# Altium schematic sheet AltiumSTM32_Schematic.SchDoc
size A3; SheetNumber: 1; SheetTotal: 1
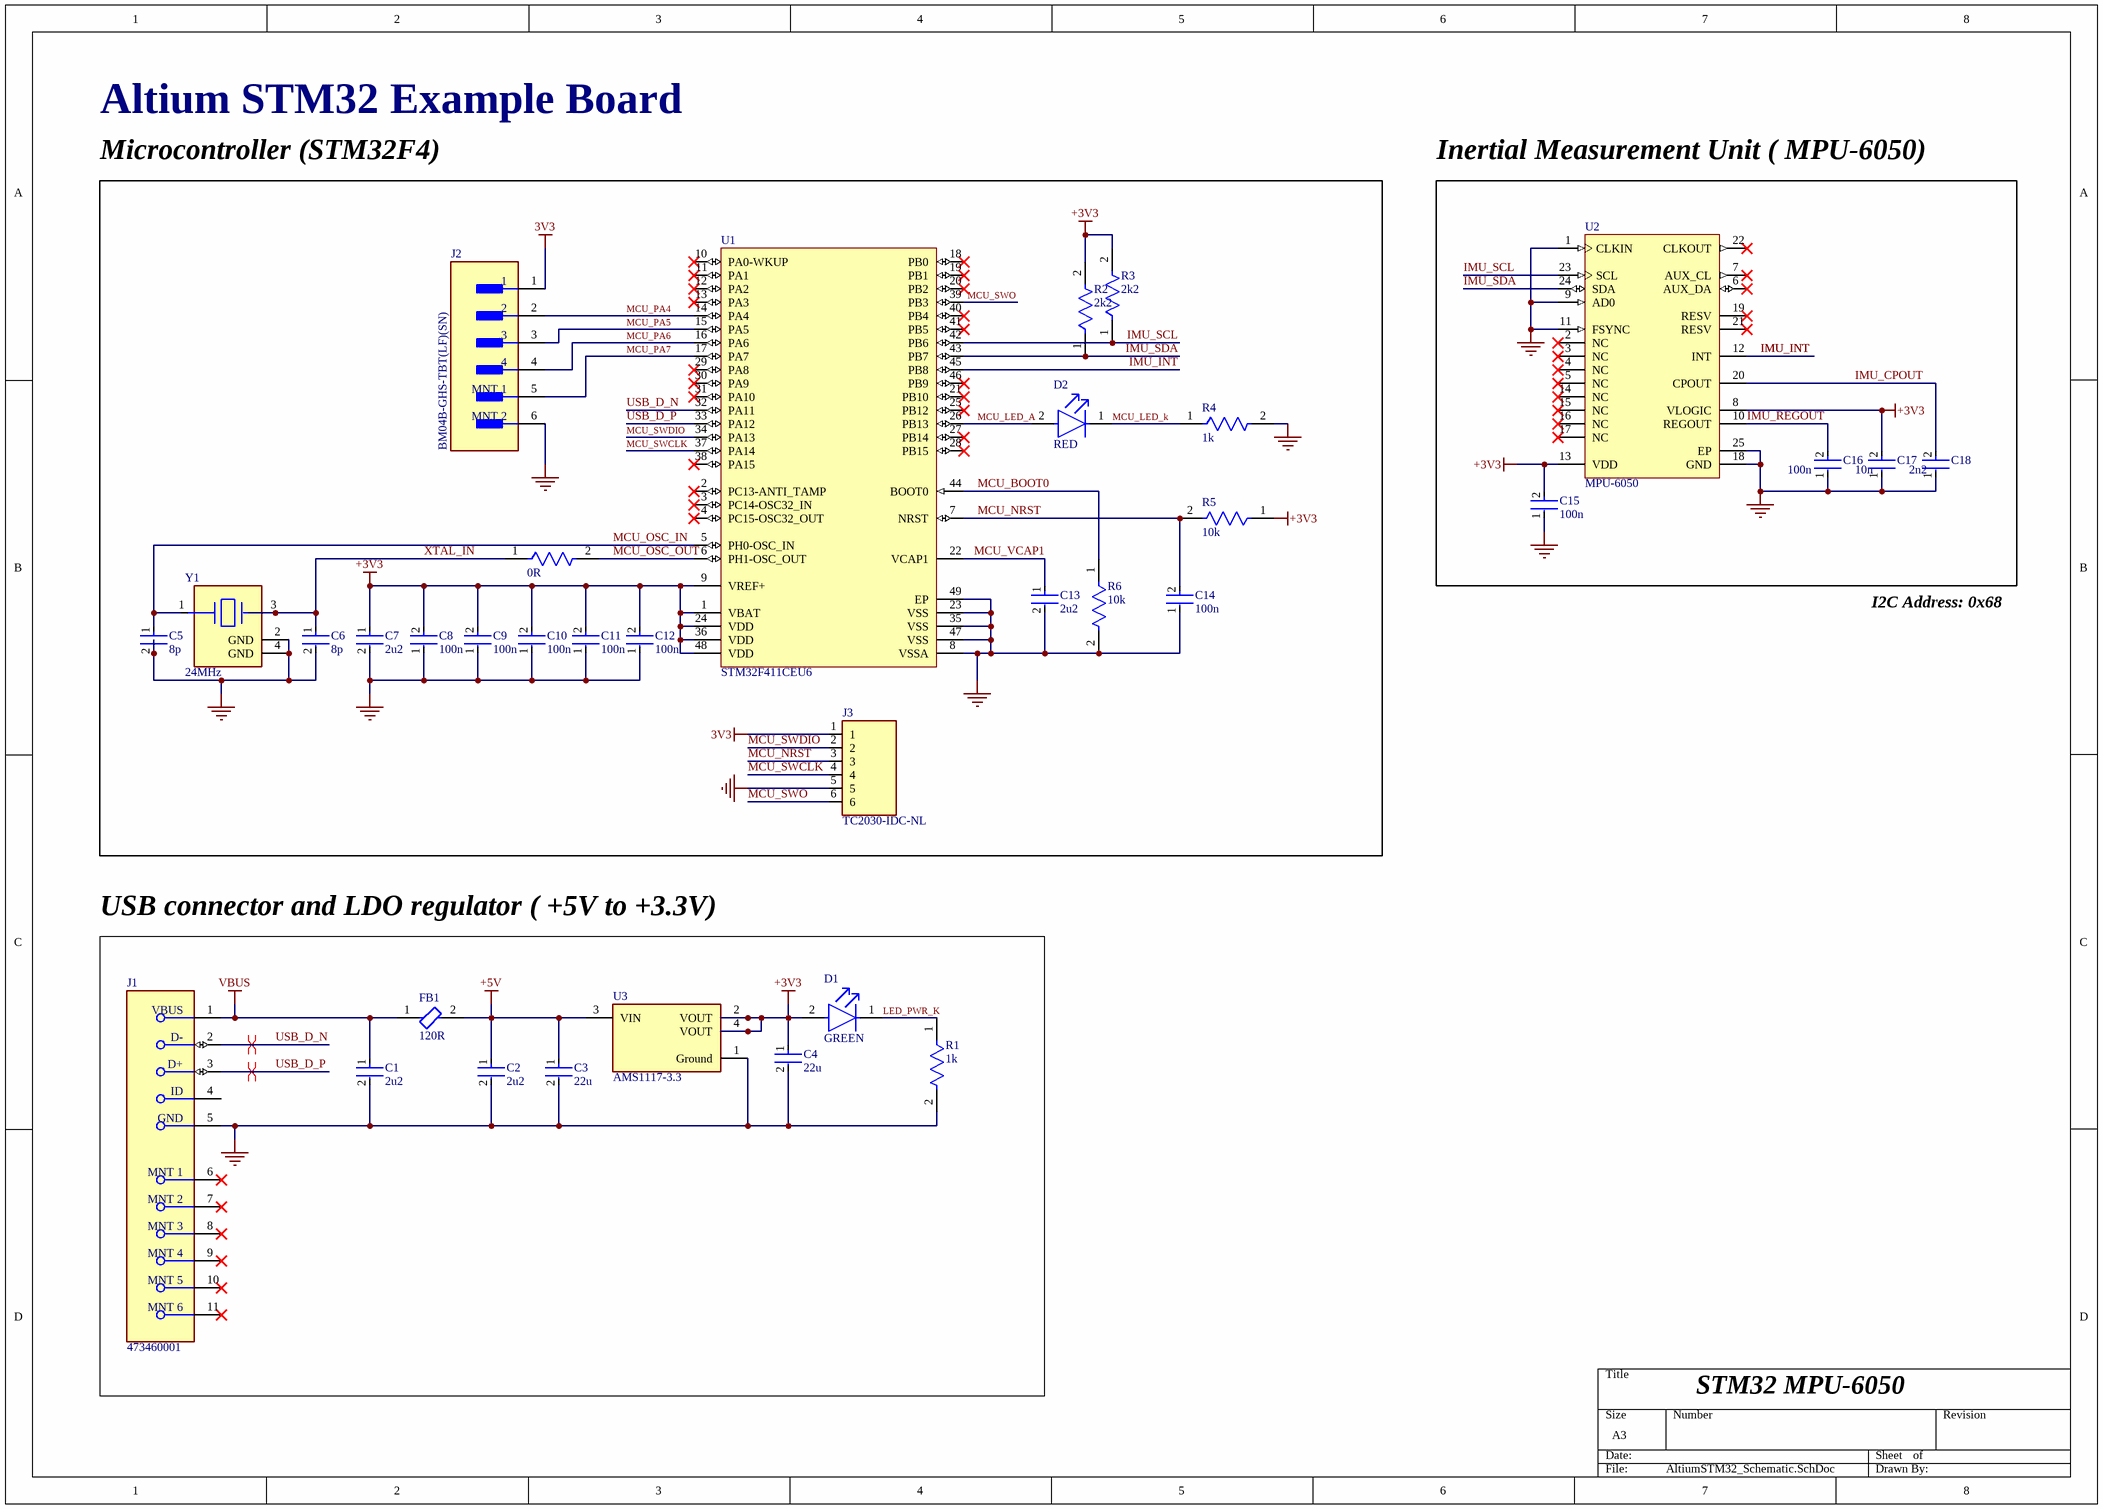
[diagram p0: AltiumSTM32_Schematic.SchDoc]

## Parts
C1  2u2  [FP-CC0603-DA-MFG]
C2  2u2  [FP-CC0603-DA-MFG]
C3  22u  [FP-GRT21B-0_2-MFG]
C4  22u  [FP-GRT21B-0_2-MFG]
C5  8p  [FP-CC0402-MFG]
C6  8p  [FP-CC0402-MFG]
C7  2u2  [FP-CC0603-DA-MFG]
C8  100n  [FP-CC0402-0_05-0_55-L2_0-MFG]
C9  100n  [FP-CC0402-0_05-0_55-L2_0-MFG]
C10  100n  [FP-CC0402-0_05-0_55-L2_0-MFG]
C11  100n  [FP-CC0402-0_05-0_55-L2_0-MFG]
C12  100n  [FP-CC0402-0_05-0_55-L2_0-MFG]
C13  2u2  [FP-CC0603-DA-MFG]
C14  100n  [FP-CC0402-0_05-0_55-L2_0-MFG]
C15  100n  [FP-CC0402-0_05-0_55-L2_0-MFG]
C16  100n  [FP-CC0402-0_05-0_55-L2_0-MFG]
C17  10n  [FP-CC0402-0_05-0_55-L2_0-MFG]
C18  2n2  [FP-CC0402-0_05-0_55-L2_0-MFG]
D1  GREEN  [FP-SML-P1-MFG]
D2  RED  [FP-SML-P1-MFG]
FB1  120R  [FP-MPZ1608-0_6-IPC_A]
J1  473460001  [FP-473460001-MFG]
J2  BM04B-GHS-TBT(LF)(SN)  [FP-BM04B-GHS-TBT_LF_SN-MFG]
J3  TC2030-IDC-NL  [TC2030-IDC-NL]
R1  1k  [FP-CRGCQ0402-IPC_C]
R2  2k2  [FP-CRGCQ0402-IPC_C]
R3  2k2  [FP-CRGCQ0402-IPC_C]
R4  1k  [FP-CRGCQ0402-IPC_C]
R5  10k  [FP-CRGCQ0402-IPC_C]
R6  10k  [FP-CRGCQ0402-IPC_C]
R7  0R  [FP-CRGCQ0402-IPC_C]
U1  STM32F411CEU6  [STM-UFQFPN48_L]
U2  MPU-6050  [IS-QFN-24_V]
U3  AMS1117-3.3  [FP-AMS1117-IPC_C]
Y1  24MHz  [FP-TSX-3225-MFG]

## Blocks framed on the sheet
Microcontroller (STM32F4): C5-C14 D2 J2 J3 R2-R7 U1 Y1
Inertial Measurement Unit ( MPU-6050): C15-C18 U2
USB connector and LDO regulator ( +5V to +3.3V): C1-C4 D1 FB1 J1 R1 U3

## Nets
3V3: J2.1 J3.1
+3V3: C4.1 C7.1 C8.2 C9.2 C10.2 C11.2 C12.2 C15.2 C17.2 D1.2(A) R2.2 R3.2 R5.1 U1.1(VBAT) U1.9(VREF+) U1.24(VDD) U1.36(VDD) U1.48(VDD) U2.8(VLOGIC) U2.13(VDD) U3.2(VOUT) U3.4(VOUT)
+5V: C2.1 C3.1 FB1.2 U3.3(VIN)
GND: C1.2 C2.2 C3.2 C4.2 C5.2 C6.2 C7.2 C8.1 C9.1 C10.1 C11.1 C12.1 C13.2 C14.1 C15.1 C16.1 C17.1 C18.1 J1.5(GND) J2.6(MNT_2) J3.5 R1.2 R4.2 R6.2 U1.8(VSSA) U1.23(VSS) U1.35(VSS) U1.47(VSS) U1.49(EP) U2.1(CLKIN) U2.9(AD0) U2.11(FSYNC) U2.18(GND) U2.25(EP) U3.1(Ground) Y1.2(GND) Y1.4(GND)
VBUS: C1.1 FB1.1 J1.1(VBUS)
IMU_CPOUT: C18.2 U2.20(CPOUT)
IMU_INT: U1.45(PB8) U2.12(INT)
IMU_REGOUT: C16.2 U2.10(REGOUT)
IMU_SCL: R3.1 U1.42(PB6) U2.23(SCL)
IMU_SDA: R2.1 U1.43(PB7) U2.24(SDA)
LED_PWR_K: D1.1(C) R1.1
MCU_BOOT0: R6.1 U1.44(BOOT0)
MCU_LED_A: D2.2(A) U1.26(PB13)
MCU_LED_k: D2.1(C) R4.1
MCU_NRST: C14.2 J3.3 R5.2 U1.7(NRST)
MCU_OSC_IN: C5.1 U1.5(PH0-OSC_IN) Y1.1
MCU_OSC_OUT: R7.2 U1.6(PH1-OSC_OUT)
MCU_PA4: J2.2 U1.14(PA4)
MCU_PA5: J2.3 U1.15(PA5)
MCU_PA6: J2.4 U1.16(PA6)
MCU_PA7: J2.5(MNT_1) U1.17(PA7)
MCU_SWCLK: J3.4 U1.37(PA14)
MCU_SWDIO: J3.2 U1.34(PA13)
MCU_SWO: J3.6 U1.39(PB3)
MCU_VCAP1: C13.1 U1.22(VCAP1)
USB_D_N: J1.2(D-) U1.32(PA11)
USB_D_P: J1.3(D+) U1.33(PA12)
XTAL_IN: C6.1 R7.1 Y1.3

Not connected (* = marked no-connect by the designer): J1 4(ID) 6(MNT_1)* 7(MNT_2)* 8(MNT_3)* 9(MNT_4)* 10(MNT_5)* 11(MNT_6)*; U1 2(PC13-ANTI_TAMP)* 3(PC14-OSC32_IN)* 4(PC15-OSC32_OUT)* 10(PA0-WKUP)* 11(PA1)* 12(PA2)* 13(PA3)* 18(PB0)* 19(PB1)* 20(PB2)* 21(PB10)* 25(PB12)* 27(PB14)* 28(PB15)* 29(PA8)* 30(PA9)* 31(PA10)* 38(PA15)* 40(PB4)* 41(PB5)* 46(PB9)*; U2 2(NC)* 3(NC)* 4(NC)* 5(NC)* 6(AUX_DA)* 7(AUX_CL)* 14(NC)* 15(NC)* 16(NC)* 17(NC)* 19(RESV)* 21(RESV)* 22(CLKOUT)*

## Layout directives
differential pair; differential pair class DIFF_USB: USB_D_N, USB_D_P

## Notes on the sheet
- Altium STM32 Example Board
- I2C Address: 0x68
- STM32 MPU-6050

## Library data of the parts
C1 C2 C7 C13 = CMP-03422-001238-1: CAP CER 2.2UF 16V X7R 0603; Manufacturer: YAGEO; Manufacturer Part Number: CC0603KRX7R7BB225; Temperature Coefficient: 15%; Material: Ceramic; Tolerance: 0.1; Voltage: 16 V; Temperature Range High: +125°C; Digikey Description: CAP CER 2.2UF 16V X7R 0603; Temperature: -55°C to +125°C; Value: 2.2 uF; Lead Free: Yes; Capacitance: 2.2 uF; Package: CC0603-DA; ComponentLink2URL: http://www.yageo.com/documents/recent/UPY-GPHC_X7R_6.3V-to-50V_18.pdf; Device Class L1: Passive Components; Category: Cap; ComponentLink2Description: Datasheet; Mouser Description: Cap Ceramic 2.2uF 16V X7R 10% Pad SMD 0603 125C Automotive T/R; Device Class L2: Capacitors; RoHS: TRUE; Automotive: No; Voltage Rating: 16 V; Device Class L3: Ceramic Capacitors; Temperature Range Low: -55°C; Height: 0.9mm; Footprint Url: http://www.yageo.com/exep/pages/download/literatures/UPY-C_GEN_24.pdf; Temperature Characteristic: X7R; Octopart: https://octopart.com/cc0603krx7r7bb225-yageo-67146440
C3 C4 = CMP-06035-049382-1: Multi-Layer Ceramic Capacitor 22uF 16V X5R ±20% 0805 Emboss T/R; Voltage Rating: 16V; Width: 0.049inch; Tolerance: 20%; Thickness: 0.057inch; Max Operating Temperature: 85°C; Mount: Surface Mount; Case Code (Metric): 2012; Capacitance: 22uF; Packaging: Tape and Reel; Case Code (Imperial): 0805; Length: 0.079inch; Ratings: AEC-Q200; Min Operating Temperature: -55°C; Case/Package: 0805
C5 C6 = CMP-03422-000060-1: CAP CER 8PF 50V NPO 0402; Manufacturer Part Number: CC0402BRNPO9BN8R0; Manufacturer: Yageo; Temperature Characteristic: NP0; Tolerance: 0.1pF; Temperature Coefficient: 30ppm/°C; Material: Ceramic; Footprint Url: https://www.yageo.com/upload/website/yageo_UPY-C_GEN_24_19050911_476.pdf; Category: Cap; ComponentLink2Description: Datasheet; Device Class L3: Ceramic Capacitors; Temperature Range High: +125°C; Automotive: No; Ipc Land Pattern Name: CAPC10050X50; Digikey Description: CAP CER 8PF 50V NPO 0402; Package: CC0402; Voltage Rating: 50V; Temperature Range Low: -55°C; Device Class L2: Capacitors; Height: 0.55mm; Octopart: https://octopart.com/cc0402brnpo9bn8r0-yageo-47310167; Value: 8pF; ComponentLink2URL: https://www.yageo.com/upload/media/product/productsearch/datasheet/mlcc/UPY-GP_NP0_16V-to-50V_18.pdf; Lead Free: Yes; Capacitance: 8pF; Device Class L1: Passive Components; Mouser Description: Multilayer Ceramic Capacitors MLCC - SMD/SMT 8.0pF 50V NPO 0.1pF; Temperature: -55°C to +125°C; RoHS: TRUE
C8-C12 C14-C18 = CMP-03422-001485-1: CAP CER 0.1UF 16V X7R 0402; Tolerance: 5%; Capacitance: 100nF; Lead Free: Lead Free; Halogen Free: Halogen Free; Voltage Rating (DC): 16V; Thickness: 0.022inch; Resistor Type: Ceramic; Min Operating Temperature: -55°C; Width: 0.02inch; Voltage Rating: 16V; Package Quantity: 10000; Case/Package: 0402; Height: 0.5mm; Dielectric: X7R; Length: 1mm; Construction: Flat; Radiation Hardening: No; Case Code (Metric): 1005; Case Code (Imperial): 0402; Series: CC; Depth: 0.5mm; RoHS Compliant: Yes; Packaging: Tape and Reel; Mount: Surface Mount; Max Operating Temperature: 125°C
D1 = CMP-08952-000015-1: LED GREEN CLEAR 1006 SMD; Manufacturer Part Number: SML-P13PTT86R; Manufacturer: Rohm; Power Dissipation: 52mW; Forward Current: 20mA; Reverse Voltage: 5V; Led Orientation: Top View; Forward Voltage: 2.1V; Luminous Intensity: 10mcd; Wavelength: 560nm; Temperature: -40°C to +85°C; Digikey Description: LED GREEN CLEAR 1006 SMD; Lead Free: Yes; Height: 0.25mm; Package: SML-P1; RoHS: TRUE; Mouser Description: LED Uni-Color Green 2-Pin Chip 0402(1006Metric) T/R; Device Class L2: LEDs; ComponentLink2URL: https://d1d2qsbl8m0m72.cloudfront.net/en/products/databook/datasheet/opto/led/chip_mono/sml-p1-e.pdf; Device Class L1: Optoelectronics; ComponentLink2Description: Datasheet; Category: Diode; Temperature Range High: +85°C; Automotive: No; Temperature Range Low: -40°C; Octopart: https://octopart.com/sml-p13ptt86r-rohm-59370256; Device Class L3: unset; Colour: Green
D2 = CMP-08952-000002-1: LED RED CLEAR 0402 SMD; Manufacturer: Rohm; Manufacturer Part Number: SML-P12VTT86R; Wavelength: 630nm; Luminous Intensity: 60mcd; Led Orientation: Top View; Forward Current: 20mA; Reverse Voltage: 5V; Power Dissipation: 50mW; Forward Voltage: 2V; Mouser Description: SML-P1 Series Red 0402 Clear 60 mcd 2V Surface Mount PICOLED? LED; Package: SML-P1; Colour: Red; Temperature Range Low: -40°C; Octopart: https://octopart.com/sml-p12vtt86r-rohm-34112315; Automotive: No; Temperature: -40°C to +85°C; Digikey Description: LED RED CLEAR 0402 SMD; ComponentLink2URL: https://www.rohm.com/datasheet/SML-P12VT(R)/sml-p1-e; Device Class L1: Optoelectronics; Device Class L3: unset; Category: Diode; Temperature Range High: +85°C; ComponentLink2Description: Datasheet; Lead Free: Yes; RoHS: TRUE; Device Class L2: LEDs; Height: 0.25mm
FB1 = CMP-08257-000019-1: FERRITE BEAD 120 OHM 0603 1LN; DC Resistance (DCR): 45mR; Test Frequency: 100MHz; Max Current Rating: 2A; Tolerance: 25%; Number of Lines: 1; Weight: 7.1E-05oz; Height: 0.03inch; Package Quantity: 4000; Termination: SMD/SMT; Max Operating Temperature: 125°C; Packaging: Tape and Reel; Width: 0.031inch; Length: 0.063inch; Case/Package: 0603; RoHS Compliant: Yes; Case Code (Metric): 1608; Min Operating Temperature: -55°C; Max DC Current: 2A; Impedance: 120R; Mount: Surface Mount; Case Code (Imperial): 0603; Ratings: AEC-Q200
J1 = CMP-2000-05246-2: CONN RCPT USB2.0 MICRO B SMD R/A; Manufacturer: Molex; Conn Orientation: Right Angle; Is Female: yes; Shielding: true; Pitch: 0.65mm; Number Of Contacts: 5; Voltage Rating: 30V; Current Rating: 1.8A; Device Class L2: USB Connectors; Digikey Description: CONN RCPT USB2.0 MICRO B SMD R/A; Height: 2.945mm; RoHS: TRUE; ComponentLink2Description: Datasheet; Octopart: https://octopart.com/47346-0001-molex-7164928; Automotive: No; Package: 0; Category: Conn; Device Class L1: Connectors; Usb Standard: USB 2.0; Temperature: -30°C to +85°C; Temperature Range Low: -30°C; Footprint Url: https://www.molex.com/pdm_docs/sd/473460001_sd.pdf; ComponentLink2URL: https://www.molex.com/webdocs/datasheets/pdf/en-us/0473460001_IO_CONNECTORS.pdf; Lead Free: Yes; Manufacturer Part Number: 473460001; Contact Material: Gold,Nickel; Temperature Range High: +85°C; Device Class L3: unset
J2 = CMP-17439-000062-2: CONN HEADER SMD 4POS 1.25MM; Number of Positions: 4; Wire/Cable Gauge: 26AWG; Current Rating: 1A; Voltage Rating (AC): 50V; Gender: Male; Orientation: Straight; Max Operating Temperature: 85°C; Pitch: 1.25mm; Contact Plating: Tin; Number of Rows: 4; Series: GH; Min Operating Temperature: -25°C; REACH SVHC: No SVHC; Packaging: Cut Tape; Lead Free: Lead Free; Voltage Rating: 50V; Contact Material: Bronze; Number of Contacts: 4; Termination: Crimp; Case/Package: SMD/SMT; Housing Color: Natural; Housing Material: Nylon
J3 = CMP-003-000003-1: CABLE ADAPTER 6 POS; Package: None; Component Type: Standard; MP: TC2030-IDC-NL; Pin Count: 6; Value: *; Source: TC2030-IDC-NL.SchLib; Price: None; Availability: Unavailable; Design Item ID: TC2030-IDC-NL
R1-R7 = CMP-03211-011107-1: CRGCQ 0402 10K 1%; Manufacturer: TE Connectivity; Manufacturer Part Number: CRGCQ0402F10K; Value: 10KΩ; Voltage Rating: 50V; Tolerance: 0.01; Temperature Coefficient: ±100ppm/°C; Power Rating: 0.0625W; Ipc Land Pattern Name: RESC10050X35; Ambient Temperature Range High: +70°C; Mouser Description: Res Thick Film 0402 10K Ohm 1% 0.063W(1/16W) ±100ppm/C Pad SMD Automotive T/R; Category: Res; Temperature Range High: +155°C; Lead Free: Yes; Device Class L1: Passive Components; ComponentLink2Description: Datasheet; Composition: Thick Film; Octopart: https://octopart.com/crgcq0402f10k-te+connectivity-91017932; ComponentLink2URL: https://www.te.com/commerce/DocumentDelivery/DDEController?Action=showdoc&DocId=Data+Sheet%7F1773204-3%7F1%7Fpdf%7FEnglish%7FENG_DS_1773204-3_1.pdf%7F4-2176347-922; Device Class L3: Chip SMD Resistors; Automotive: Yes; RoHS: TRUE; Digikey Description: CRGCQ 0402 10K 1%; Device Class L2: Resistors; Temperature: -55°C to +155°C; Series: CRGCQ; Height: 0.4mm; Package: CRGCQ0402; Temperature Range Low: -55°C; Resistance: 10KΩ
U1 = CMP-0243-00165-1: ARM Cortex-M4 32-bit MCU+FPU, 512 KB Flash, 128 KB RAM, 36 I/Os, 48-Pin UFQFPN, -40 to 85 degC, Tray; Operating Frequency(F) (Processor speed) (MHz): 100; FLASH Size (Prog) (kB): 512; Internal RAM Size (kB): 128; I/Os (High Current): 36; Supply Voltage(Vcc) min (V): 1.7; Package Reference: 48-Pin Ultra Thin Fine Pitch Quad Flat No-Lead, 7 x 7 x 0.6 mm Body, 0.5 mm Pitch, Exposed Pad; ComponentLink1Description: Manufacturer URL; ComponentLink1URL: http://www.st.com/; Packing: Tray; Package Description: UFQFPN48; Core: ARM Cortex-M4; ComponentLink2Description: Datasheet; ComponentLink2URL: http://www.st.com/st-web-ui/static/active/en/resource/technical/document/datasheet/DM00115249.pdf; DatasheetVersion: Rev. 6; Mounting Technology: Surface Mount
U2 = CMP-1753-00002-2: 3-Axis Gyroscope, Accelerometer and a Digital Motion Processor(TM) (DMP), 2.375 to 3.46 V, -40 to 85 degC, 24-Pin QFN, RoHS, Tape and Reel; Manufacturer: InvenSense; Featured Product: MPU-60506-Axis,IntegratedI²CSolution; Other Names: 1428-1007-2 / MPU6050; Sensor Type: MotionTracking; Online Catalog: MPU-6000™Series; Unit PriceUSD: Digital; Datasheet Version: Rev. 3.3, 05/2012; Category: Sensors,Transducers; Datasheet URL: http://datasheet.octopart.com/MPU-6050-InvenSense-datasheet-14421344.pdf; Family: Multifunction; Standard Package: 5,000; Manufacturer URL: http://www.invensense.com/; Output Type: Digital; Dynamic Catalog: MPU-6000™Series
U3 = CMP-209535-000001-1: LDO Voltage Regulators 1A, 3.3V; Manufacturer: Advanced Monolithic Systems; Dropout Voltage: 1.1V; Output Type: Fixed; Nominal Supply Current: 5mA; Max Power Dissipation: 1.2W; Max Supply Voltage: 15V; Number Of Outputs: 1; Standoff Height: 0.64mm; Max Junction Temp: +125°C; Height: 1.8mm; Package: AMS1117; Device Class L2: Power Management ICs; ComponentLink2Description: Datasheet; ComponentLink2URL: http://www.advanced-monolithic.com/pdf/ds1117.pdf; Category: IC; RoHS: TRUE; Automotive: No; Device Class L1: Integrated Circuits (ICs); Output Current: 1A; Device Class L3: Voltage Regulators - Linear; Temperature: -40°C to +125°C; Output Voltage: 3.3V; Manufacturer Part Number: AMS1117-3.3; Temperature Range Low: -40°C; Octopart: https://octopart.com/ams1117-3.3-advanced+monolithic+systems-25899300; Lead Free: Yes; Ipc Land Pattern Name: SOT229P700X180-4; Temperature Range High: +125°C
Y1 = CMP-36405-000018-1: CRYSTAL 24.0000MHZ 9PF SMD; ESR (Equivalent Series Resistance): 40R; Frequency Stability: 20ppm; Tolerance: 10ppm; Drive Level: 200uW; Min Operating Temperature: -40°C; RoHS Compliant: Yes; Width: 2.5mm; Max Operating Temperature: 105°C; Package Quantity: 250; Load Capacitance: 9pF; Mount: Surface Mount; Lead Free: Lead Free; Height: 0.024inch; Depth: 2.5mm; Frequency: 24MHz; Packaging: Tape and Reel; Series: TSX-3225; Weight: 0.000564oz; Number of Pins: 4; Termination: SMD/SMT; Case/Package: SMD/SMT; Length: 3.2mm; Frequency Tolerance: 10ppm